# Altium schematic sheet 86mm_Holder.SchDoc
size A4
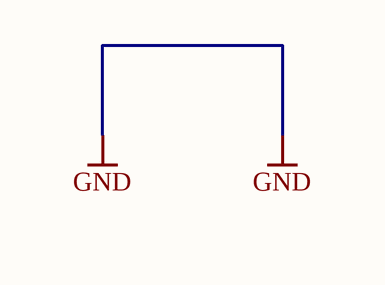
[diagram p0: 86mm_Holder.SchDoc]